# EAGLE design teensy_rfm69cw_nrf_lower (EAGLE 6.5.0)
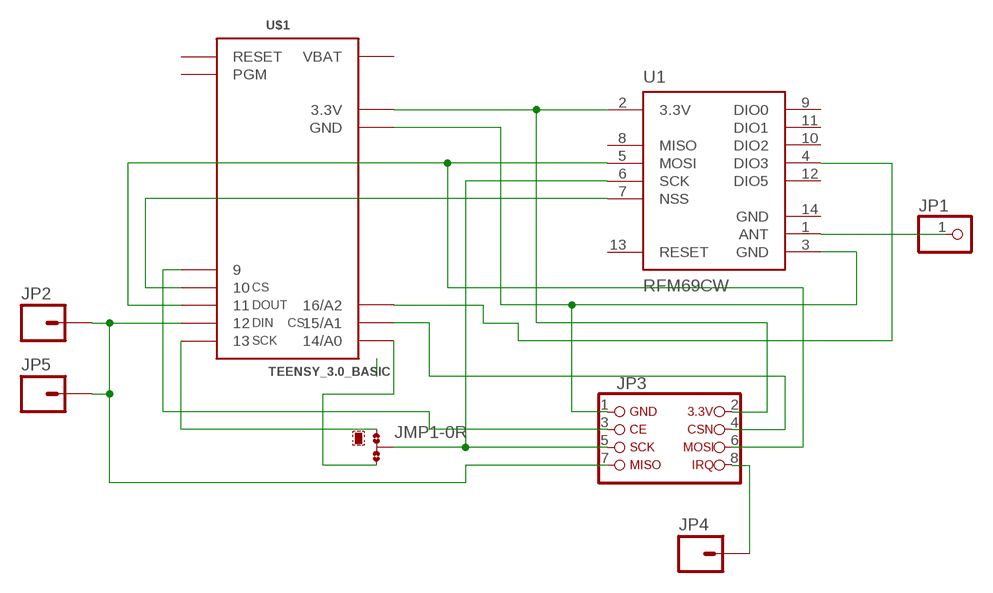
[diagram p0: schematic, sheet 1]

## Parts
JMP1  0R-JUMPA  [A0R-JMP]
JP1  PINHD-1X1  [1X01]
JP2  M01SMD-4.5X1.5  [PAD-1.5X4.5]
JP3  NRF24  [NRF24]
JP4  M01SMD-4.5X1.5  [PAD-1.5X4.5]
JP5  M01SMD-4.5X1.5  [PAD-1.5X4.5]
U1  RFM69CW  [RFM69CW-XXXS2]
U$1  TEENSY_3.0_BASIC  [TEENSY_3.0_BASIC]

## Nets
N$1 [power]: JP3.2 U1.2(3.3V) U$1.3.3V1(3.3V)
N$2 [power]: JP3.1 U1.3(GND) U$1.GND1(GND)
N$4: JP3.4 U$1.15/A1
N$5: JP3.6 U1.5(MOSI) U$1.11
N$6: JMP1.1 U$1.13
N$7: JMP1.3 U$1.14/A0
N$8: U1.7(NSS) U$1.10
N$9: U1.4(DIO3) U$1.16/A2
N$10: JP1.1 U1.1(ANT)
N$11: JMP1.2 JP3.5 U1.6(SCK)
N$12: JP2.P$1 JP3.7 JP5.P$1 U$1.12
N$13: JP3.3 U$1.9
N$15: JP3.8 JP4.P$1
Unconnected: U1.8(MISO) U1.9(DIO0) U1.10(DIO2) U1.11(DIO1) U1.12(DIO5) U1.13(RESET) U$1.PGM U$1.RESET

## Power pins joined to a net without a drawn wire
GND: U1.14(GND)
VBAT: U$1.VBAT

## Library data of the parts
JMP1 = jump-0r-smd:0R-JUMP: SMD 0R 0805 Jumper
JP1 = pinhead:PINHD-1X1: PIN HEADER
JP2 JP4 JP5 = mike-temp:M01: Header 1 Standard 1-pin 0.1" header. Use with straight break away headers (SKU : PRT-00116), right angle break away headers (PRT-00553), swiss pins (PRT-00743), machine pins (PRT-00117), and female headers (PRT-00115).
JP3 = teensy_nrf_parts:NRF24: PIN HEADER
U1 = mike-temp:RFM69
U$1 = teensy_nrf_parts:TEENSY_3.0_BASIC: Basic Teensy 3.0 with none of the 'inner' pins enabled. See '+4', 'AllAnalogPins", and 'AllPins' packages for additional pin holes, as needed.

## Net classes
0 default: width 0.305 mm
1 power: width 0.61 mm

## Board
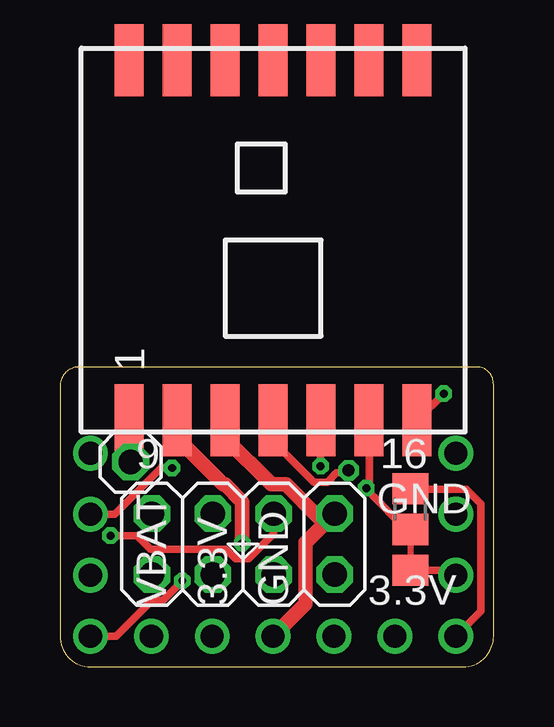
[diagram p1: board, top side]
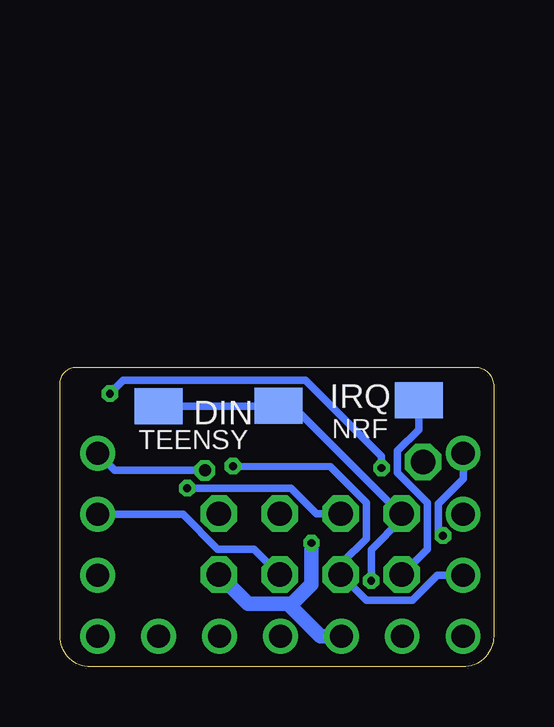
[diagram p2: board, bottom side, seen from below]

Size 18.09 x 12.49 mm. Coordinates in mm from the lower left corner, seen from the top.
Outline: 17.4,12.49 0.76,12.49 arc90 0,11.67 0,1.27 arc90 1.27,0 16.82,0 arc90 18.09,1.27 18.09,11.78 arc90 17.4,12.49
Copper layers (1*16): Top 0.0356mm / dielectric 1.5011mm / Bottom 0.0356mm
Design rules "LaenPCBOrder": minimum track width 6mil, minimum drill 13mil, track to track 6mil, track to pad 6mil, pad to pad 6mil, via to via 6mil, smd to smd 6mil, copper to edge 15mil, drill to drill 6mil, minimum pad ring 7mil, minimum via ring 7mil, stop-mask expansion 3mil, vias tented up to drill 0mil, thermal gap 10mil

### Footprints (pad centres in the part's own frame; a part is rotated, then mirrored left to right if it is on the bottom)
A0R-JMP = smd 1.5 x 1.3: 1 0,1.7; 2 0,0; 3 0,-1.7
1X01 = drill 1.016 octagon: 1 0,0
PAD-1.5X4.5 = smd 1.5 x 2: P$1 0,0
NRF24 = drill 1.016 octagon: 1 -3.81,-1.27; 2 -3.81,1.27; 3 -1.27,-1.27; 4 -1.27,1.27; 5 1.27,-1.27; 6 1.27,1.27; 7 3.81,-1.27; 8 3.81,1.27
RFM69CW-XXXS2 = smd 3 x 1.2: 1 -7.5,6; 2 -7.5,4; 3 -7.5,2; 4 -7.5,0; 5 -7.5,-2; 6 -7.5,-4; 7 -7.5,-6; 8 7.5,-6; 9 7.5,-4; 10 7.5,-2; 11 7.5,0; 12 7.5,2; 13 7.5,4; 14 7.5,6
TEENSY_3.0_BASIC = drill 0.965: 3.3V1 -2.54,-5.08; 9 -7.62,2.54; 10 -7.62,0; 11 -7.62,-2.54; 12 -7.62,-5.08; 13 7.62,-5.08; 14/A0 7.62,-2.54; 15/A1 7.62,0; 16/A2 7.62,2.54; GND1 0,-5.08; PGM 2.54,-5.08; RESET 5.08,-5.08; VBAT -5.08,-5.08

### Placement (x,y rotation side)
JMP1  14.61,5.71 0 top
JP1  2.95,8.53 0 top
JP2  13.97,10.85 270 bottom
JP3  7.65,5.11 180 top
JP4  3.12,11.1 90 bottom
JP5  8.97,10.87 270 bottom
U1  8.89,17.78 90 top
U$1  8.89,6.35 0 top

### Tracks (layer width: path | path; a pad name or v marks a point on that pad's centre or on a via)
N$1  (via drill 0.33)
  Top 0.61: v7.59,5.16 7.59,6.88 6.88,7.59 6.81,7.59 4.9,9.5 4.9,10.26 U1.2
  Bottom 0.61: U$1.3.3V1 7.21,1.27 8.48,2.54 | 8.48,2.54 8.56,2.62 10.24,2.62 JP3.2 | v7.59,5.16 7.59,3.43 8.48,2.54
N$2
  Top 0.61: U$1.GND1 10.24,2.62 10.24,5.16 JP3.1 10.85,6.17 9.42,7.59 8.81,7.59 6.88,9.53 6.88,10.26 U1.3
N$3
  Top 0.254: 14.61,5.16 14.61,4.6
N$4
  Bottom 0.305: U$1.15/A1 12.95,6.35 11.51,4.9 9.98,4.9 JP3.4
N$5  (via drill 0.33)
  Top 0.305: v10.87,8.36 10.87,10.26 U1.5
  Bottom 0.305: U$1.11 2.34,3.81 3.38,2.77 5.31,2.77 JP3.6 6.3,3.96 6.3,4.34 5.31,5.33 5.31,6.83 6.81,8.33 v10.87,8.36
N$6
  Top 0.305: U$1.13 17.55,2.31 17.55,6.78 16.94,7.39 14.61,7.39 JMP1.1
N$7
  Top 0.305: U$1.14/A0 16.31,4.01 JMP1.3
N$8  (via drill 0.33)
  Top 0.305: U$1.10 2.29,6.35 4.22,8.28 v4.67,8.28 | v16,11.38 14.91,10.29 U1.7
  Bottom 0.305: v4.67,8.28 4.67,8.76 7.85,11.94 15.44,11.94 v16,11.38
N$9  (via drill 0.5 pad 0.25)
  Top 0.305: U1.4 8.89,9.58 8.91,9.55 8.91,9.37 10.59,7.7 11.15,7.7 11.53,8.08 11.94,8.08 v12.04,8.18
  Bottom 0.305: v12.04,8.18 15.8,8.18 U$1.16/A2
N$10
  Top 0.305: JP1.1 2.9,8.59 2.9,10.26 U1.1
N$11  (via drill 0.33)
  Top 0.305: JMP1.2 14.45,5.71 12.9,7.26 12.9,7.44 | 12.9,7.44 12.9,10.26 U1.6 | v12.78,7.44 12.9,7.44
  Bottom 0.305: JP3.5 7.39,6.38 8.46,7.44 v12.78,7.44
N$12  (via drill 0.33)
  Top 0.305: U$1.12 2.34,1.27 3.83,2.77 4.29,2.77 v5.11,3.58
  Bottom 0.305: JP2.P$1 8.99,10.85 JP5.P$1 8.84,10.79 8.31,10.79 3.96,6.45 JP3.7 3.83,6.15 5.11,4.88 v5.11,3.58
N$13  (via drill 0.33)
  Top 0.305: v2.11,5.46 3.23,5.46 3.79,4.9 6.91,4.9 7.32,4.5 7.87,4.5 8.91,5.54 JP3.3
  Bottom 0.305: U$1.9 1.27,7.82 2.31,6.78 2.31,5.66 v2.11,5.46
N$15
  Bottom 0.305: JP4.P$1 3.12,9.88 4.01,8.99 4.01,8.08 2.77,6.83 2.77,4.9 JP3.8

### Text on the board
bNames: IRQ | NRF | DIN | TEENSY